# Altium schematic sheet FPGA_PRGSETUP.SchDoc: XC3S1500-4FG676C Configuration
size A4; Organization: Altium Limited.; Address1: Level 3, 12a Rodborough Rd; Address2: Frenchs Forest 2086; Address3: NSW; Address4: AUSTRALIA; DocumentNumber: 13; Revision: 6; SheetNumber: 13; SheetTotal: 64; PageSetup: Record=PageOptions|CenterHorizontal=True|CenterVertical=True|PrintScale=0.97|XCorrection=1.00|YCorrection=1.00|PrintKind=0|BorderSize=5000000|LeftOffset=0|BottomOffset=0|Orientation=2|PaperLength=1000|PaperWidth=1000|Scale=100|PaperSource=7|PrintQuality=-4|MediaType=1|DitherType=10|PaperKind=A4 (210 x 297mm)|PrintScaleMode=1
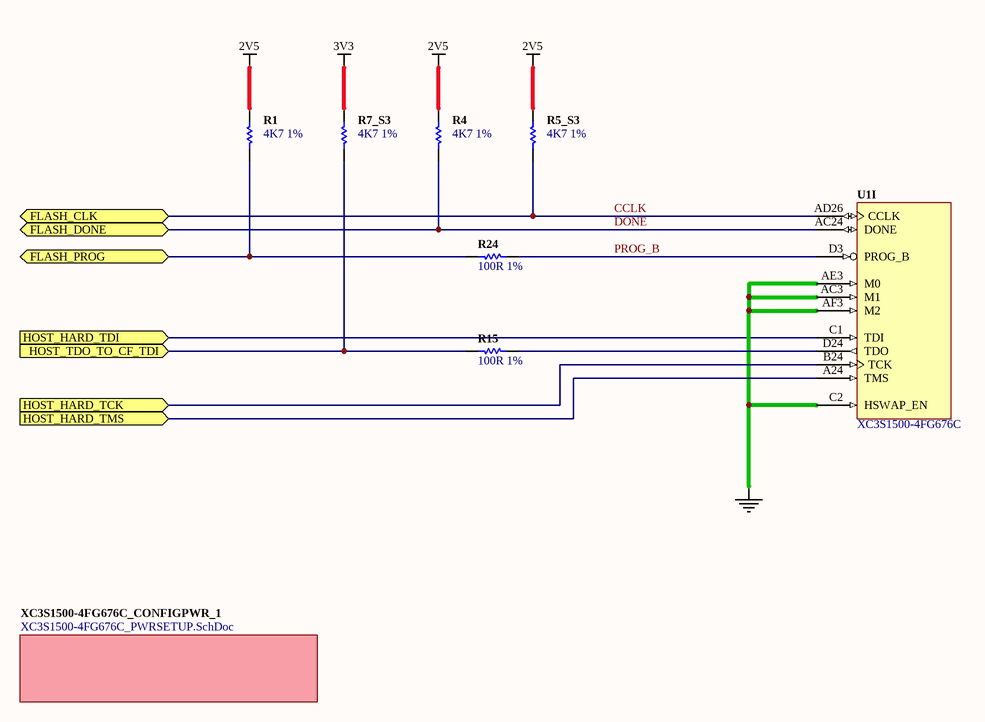
[diagram p0: FPGA_PRGSETUP.SchDoc]

## Parts
R1  4K7 1%  [RESC1005-STAR]
R4  4K7 1%  [RESC1005-STAR]
R5_S3  4K7 1%  [RESC1005-STAR]
R7_S3  4K7 1%  [RESC1005-STAR]
R15  100R 1%  [RESC1005-STAR]
R24  100R 1%  [RESC1005-STAR]
U1  XC3S1500-4FG676C  [BGA100P26X26-676]  (part I of 12)

## Sub-sheets
XC3S1500-4FG676C_CONFIGPWR_1 = XC3S1500-4FG676C_PWRSETUP.SchDoc: no entries

## Ports
FLASH_CLK (bidir), FLASH_DONE (bidir), FLASH_PROG (bidir), HOST_HARD_TCK (in), HOST_HARD_TDI (in), HOST_HARD_TMS (in), HOST_TDO_TO_CF_TDI (in)

## Nets
2V5: R1.1 R4.1 R5_S3.1
3V3: R7_S3.1
GND: U1.AC3(M1) U1.AE3(M0) U1.AF3(M2) U1.C2(HSWAP_EN)
CCLK: R5_S3.2 U1.AD26(CCLK) ; port FLASH_CLK
DONE: R4.2 U1.AC24(DONE) ; port FLASH_DONE
FLASH_PROG: R1.2 R24.2 ; port FLASH_PROG
HOST_HARD_TCK: U1.B24(TCK) ; port HOST_HARD_TCK
HOST_HARD_TDI: U1.C1(TDI) ; port HOST_HARD_TDI
HOST_HARD_TMS: U1.A24(TMS) ; port HOST_HARD_TMS
HOST_TDO_TO_CF_TDI: R7_S3.2 R15.2 ; port HOST_TDO_TO_CF_TDI
PROG_B: R24.1 U1.D3(PROG_B)
NetR15_1: R15.1 U1.D24(TDO)

## Notes on the sheet
- Sheet Title
- Project Title
- Size:
- Date:
- A4
- Assy:
- Time:
- Sheet
- Revision:
- of
- File:

## Library data of the parts
R1 R4 R5_S3 R7_S3 = D-100-0088: Resistor, 4K7 1% 0402 (1005); Power Rating: 63 mW; Resistance: 4.7 K; Category: Resistor; Mounting Technology: Surface Mount; Status: Production; Tolerance: 1 %
R15 R24 = D-100-0131: Resistor, 100R 1% 0402 (1005); Power Rating: 63 mW; Category: Resistor; Mounting Technology: Surface Mount; Resistance: 100 R; Status: Production; Tolerance: 1 %
U1 = D-241-0001: FPGA, Xilinx Spartan3-1500 FG676 Speed=4; EnablePinSwap: True; Supply Voltage: mV; Category: IC-FPGA; Mounting Technology: Surface Mount; Status: Production; Technology: None